# Altium project ECE453-MCU.PrjPcb (part 2 of 3)

## Sheet 03_Connectors.SchDoc: Connectors
size A; Revision: A; SheetNumber: 3; SheetTotal: 8; ECE315_Project_Name: ECE453 Processor Mezzanine
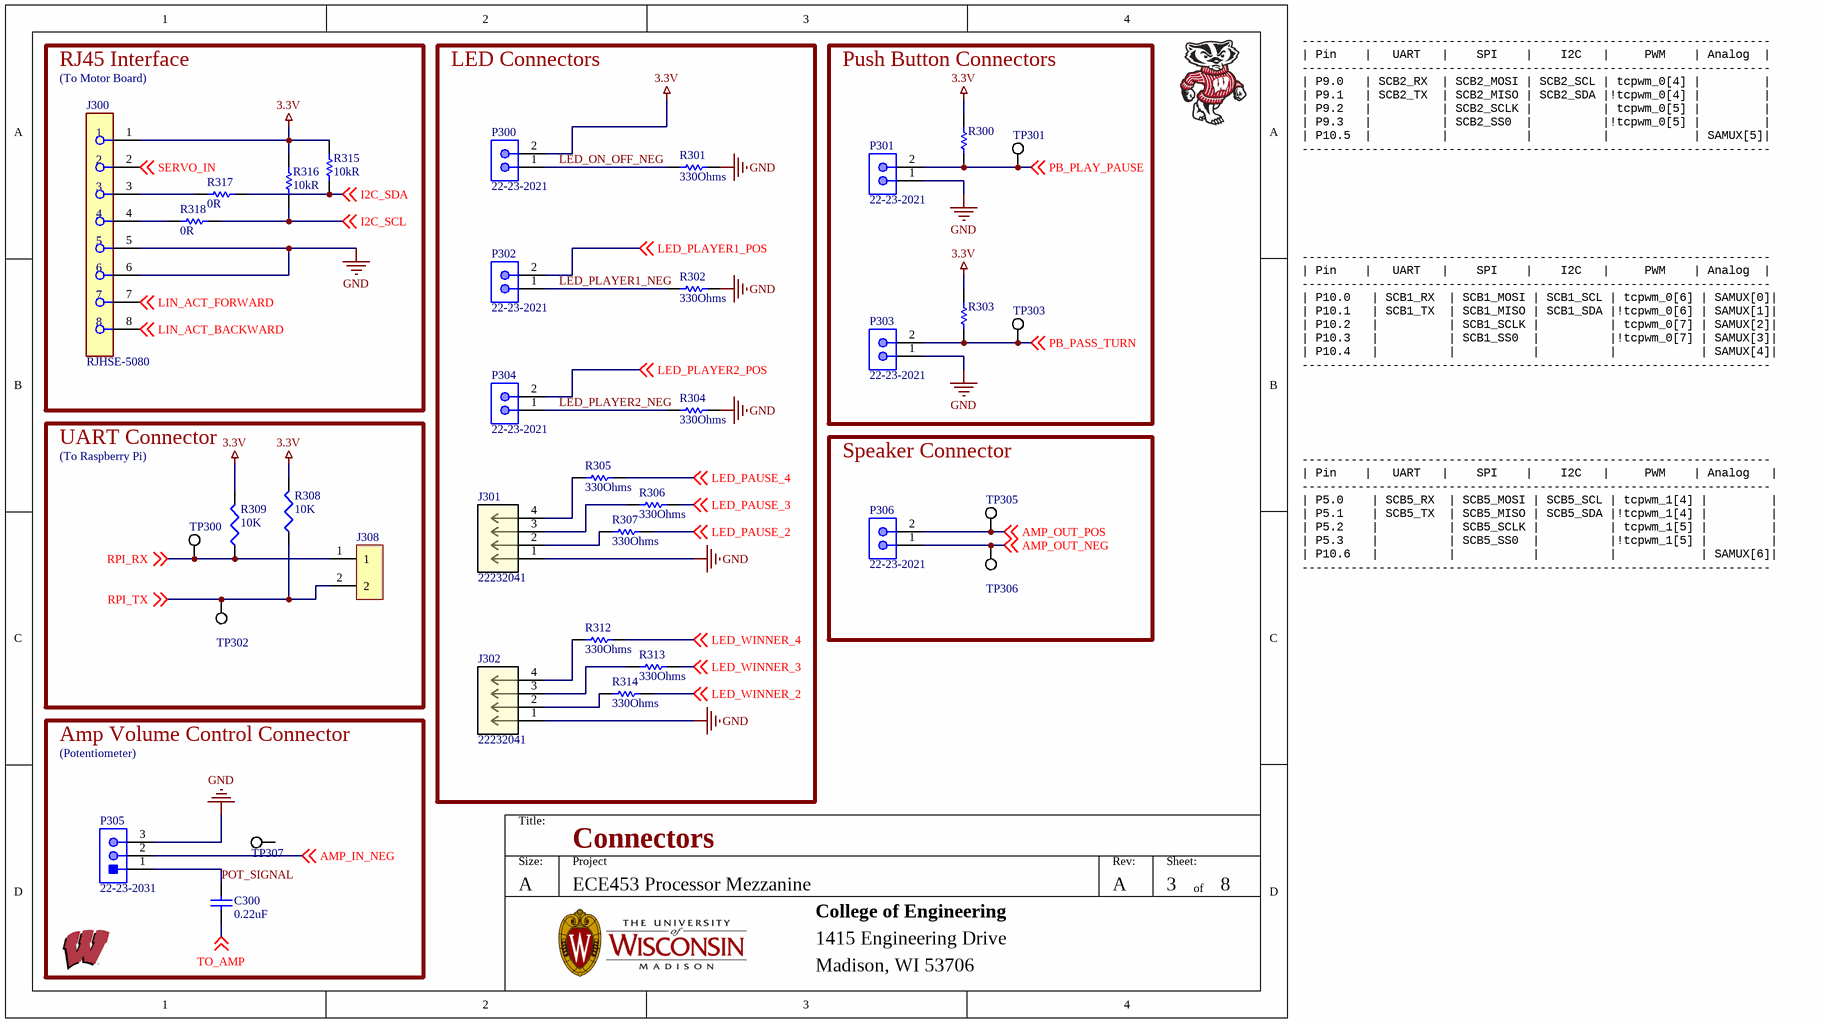
[diagram p3: 03_Connectors.SchDoc]

### Parts
C300  0.22uF  [CAPC2012M]
J300  RJHSE-5080  [FP-RJHSE-5080-MFG]
J301  22232041  [CONN_22-23-2041_MOL]
J302  22232041  [CONN_22-23-2041_MOL]
J308  (no value)  [PHOENIX2X0.2]
P300  22-23-2021  [MOLX-22-23-2021_V]
P301  22-23-2021  [MOLX-22-23-2021_V]
P302  22-23-2021  [MOLX-22-23-2021_V]
P303  22-23-2021  [MOLX-22-23-2021_V]
P304  22-23-2021  [MOLX-22-23-2021_V]
P305  22-23-2031  [MOLX-22-23-2031_V]
P306  22-23-2021  [MOLX-22-23-2021_V]
R300  RC0805FR-0710KL  [RESC2013X60X35NL10T20]  (value not drawn)
R301  Resistance: 330Ohms  [RESC2013X60X35LL10T20]  (hidden comment: RC0805FR-07330RL)
R302  Resistance: 330Ohms  [RESC2013X60X35LL10T20]  (hidden comment: RC0805FR-07330RL)
R303  RC0805FR-0710KL  [RESC2013X60X35NL10T20]  (value not drawn)
R304  Resistance: 330Ohms  [RESC2013X60X35LL10T20]  (hidden comment: RC0805FR-07330RL)
R305  Resistance: 330Ohms  [RESC2013X60X35LL10T20]  (hidden comment: RC0805FR-07330RL)
R306  Resistance: 330Ohms  [RESC2013X60X35LL10T20]  (hidden comment: RC0805FR-07330RL)
R307  Resistance: 330Ohms  [RESC2013X60X35LL10T20]  (hidden comment: RC0805FR-07330RL)
R308  10K  [RESC2012M]
R309  10K  [RESC2012M]
R312  Resistance: 330Ohms  [RESC2013X60X35LL10T20]  (hidden comment: RC0805FR-07330RL)
R313  Resistance: 330Ohms  [RESC2013X60X35LL10T20]  (hidden comment: RC0805FR-07330RL)
R314  Resistance: 330Ohms  [RESC2013X60X35LL10T20]  (hidden comment: RC0805FR-07330RL)
R315  Resistance: 10kR  [RESC2013X60X35NL10T20]  (hidden comment: RC0805FR-0710KL)
R316  Resistance: 10kR  [RESC2013X60X35NL10T20]  (hidden comment: RC0805FR-0710KL)
R317  value 0R  [RESC2013X70X40NL20T20]  (hidden comment: ERJ-6GEY0R00V)
R318  value 0R  [RESC2013X70X40NL20T20]  (hidden comment: ERJ-6GEY0R00V)
TP300  5019  [KSTN-5019_V]  (value not drawn)
TP301  5019  [KSTN-5019_V]  (value not drawn)
TP302  5019  [KSTN-5019_V]  (value not drawn)
TP303  5019  [KSTN-5019_V]  (value not drawn)
TP305  5019  [KSTN-5019_V]  (value not drawn)
TP306  5019  [KSTN-5019_V]  (value not drawn)
TP307  5019  [KSTN-5019_V]  (value not drawn)

### Blocks framed on the sheet
RJ45 Interface: J300 R315-R318
LED Connectors: J301 J302 P300 P302 P304 R301 R302 R304-R307 R312-R314
Push Button Connectors: P301 P303 R300 R303 TP301 TP303
UART Connector: J308 R308 R309 TP300 TP302
Speaker Connector: P306 TP305 TP306
Amp Volume Control Connector: C300 P305 TP307

### Nets
3.3V: J300.1 P300.2 R300.2 R303.2 R308.2 R309.2 R315.2 R316.2
GND: J300.5 J300.6 J301.1 J302.1 P301.1 P303.1 P305.3 R301.1 R302.1 R304.1
AMP_IN_NEG: P305.2 ; off-sheet AMP_IN_NEG
AMP_OUT_NEG: P306.1 TP306.1 ; off-sheet AMP_OUT_NEG
AMP_OUT_POS: P306.2 TP305.1 ; off-sheet AMP_OUT_POS
I2C_SCL: R316.1 R318.2 ; off-sheet I2C_SCL
I2C_SDA: R315.1 R317.2 ; off-sheet I2C_SDA
LED_ON_OFF_NEG: P300.1 R301.2
LED_PAUSE_2: R307.1 ; off-sheet LED_PAUSE_2
LED_PAUSE_3: R306.1 ; off-sheet LED_PAUSE_3
LED_PAUSE_4: R305.1 ; off-sheet LED_PAUSE_4
LED_PLAYER1_NEG: P302.1 R302.2
LED_PLAYER1_POS: P302.2 ; off-sheet LED_PLAYER1_POS
LED_PLAYER2_NEG: P304.1 R304.2
LED_PLAYER2_POS: P304.2 ; off-sheet LED_PLAYER2_POS
LED_WINNER_2: R314.1 ; off-sheet LED_WINNER_2
LED_WINNER_3: R313.1 ; off-sheet LED_WINNER_3
LED_WINNER_4: R312.1 ; off-sheet LED_WINNER_4
LIN_ACT_BACKWARD: J300.8 ; off-sheet LIN_ACT_BACKWARD
LIN_ACT_FORWARD: J300.7 ; off-sheet LIN_ACT_FORWARD
PB_PASS_TURN: P303.2 R303.1 TP303.1 ; off-sheet PB_PASS_TURN
PB_PLAY_PAUSE: P301.2 R300.1 TP301.1 ; off-sheet PB_PLAY_PAUSE
POT_SIGNAL: C300.1 P305.1
RPI_RX: J308.1 R309.1 TP300.1 ; off-sheet RPI_RX
RPI_TX: J308.2 R308.1 TP302.1 ; off-sheet RPI_TX
SERVO_IN: J300.2 ; off-sheet SERVO_IN
TO_AMP: C300.2 ; off-sheet TO_AMP
NetJ300_3: J300.3 R317.1
NetJ300_4: J300.4 R318.1
NetJ301_2: J301.2 R307.2
NetJ301_3: J301.3 R306.2
NetJ301_4: J301.4 R305.2
NetJ302_2: J302.2 R314.2
NetJ302_3: J302.3 R313.2
NetJ302_4: J302.4 R312.2

Not connected (* = marked no-connect by the designer): TP307 1

### Notes on the sheet
- (To Motor Board)
- -------------------------------------------------------------------
  | Pin    |   UART   |    SPI    |    I2C   |     PWM    | Analog  |
  -------------------------------------------------------------------
  | P9.0   | SCB2_RX  | SCB2_MOSI | SCB2_SCL | tcpwm_0[4] |         |
  | P9.1   | SCB2_TX  | SCB2_MISO | SCB2_SDA |!tcpwm_0[4] |         |
  | P9.2   |          | SCB2_SCLK |          | tcpwm_0[5] |         |
  | P9.3   |          | SCB2_SS0  |          |!tcpwm_0[5] |         |
  | P10.5  |          |           |          |            | SAMUX[5]|
  -------------------------------------------------------------------
- -------------------------------------------------------------------
  | Pin    |   UART   |    SPI    |    I2C   |     PWM    | Analog  |
  -------------------------------------------------------------------
  | P10.0   | SCB1_RX  | SCB1_MOSI | SCB1_SCL | tcpwm_0[6] | SAMUX[0]|
  | P10.1   | SCB1_TX  | SCB1_MISO | SCB1_SDA |!tcpwm_0[6] | SAMUX[1]|
  | P10.2   |          | SCB1_SCLK |          | tcpwm_0[7] | SAMUX[2]|
  | P10.3   |          | SCB1_SS0  |          |!tcpwm_0[7] | SAMUX[3]|
  | P10.4   |          |           |          |            | SAMUX[4]|
  -------------------------------------------------------------------
- (To Raspberry Pi)
- -------------------------------------------------------------------
  | Pin    |   UART   |    SPI    |    I2C   |     PWM    | Analog   |
  -------------------------------------------------------------------
  | P5.0    | SCB5_RX  | SCB5_MOSI | SCB5_SCL | tcpwm_1[4] |         |
  | P5.1    | SCB5_TX  | SCB5_MISO | SCB5_SDA |!tcpwm_1[4] |         |
  | P5.2    |          | SCB5_SCLK |          | tcpwm_1[5] |         |
  | P5.3    |          | SCB5_SS0  |          |!tcpwm_1[5] |         |
  | P10.6   |          |           |          |            | SAMUX[6]|
  -------------------------------------------------------------------
- (Potentiometer)
- Title:
- Size:
- A
- Project
- Rev:
- Sheet:
- of
- College of Engineering
- 1415 Engineering Drive
- Madison, WI 53706

### Library data of the parts
C300 = Cap_2: Cap Ceramic 0.22uF 50V X7R 10% SMD 0805 125°C Plastic T/R; Manufacturer: KEMET; Manufacturer Part Number: C0805C224K5RACAUTO7210; Supplier 1: Digi-Key; Supplier Part Number 1: 399-C0805C224K5RACAUTO7210CT-ND; RoHS: Yes; Category: Ceramic Capacitors; Stock 1: 24243; Pricing 1: 1=0.19000, 10=0.12800, 50=0.07680, 100=0.06490, 500=0.04438, 1000=0.03926, 2500=0.03755, 5000=0.03414 (USD); RoHS Compliant: Yes; Value: 0.22uF
J300 = CMP-02366-000003-1: CONN MOD JACK 8P8C R/A UNSHLD; Manufacturer: Amphenol; Current Rating: 1.5A; Voltage Rating: 125V; Pitch: 1.02mm; Conn Orientation: Right Angle; Number Of Contacts: 8; Is Female: yes; Conn Gender: Female; Lead Free: Yes; Device Class L3: unset; Footprint Url: https://cdn.amphenol-icc.com/media/wysiwyg/files/drawing/rjhse5080.pdf?__cf_chl_jschl_tk__=e349db0bbbb6188a39347cd5e541b92fa02c9719-1587748343-0-AW7tChdeHzRPLX9gSWj7WrKaXQoY9BsmT9Ek0h-T62M9y3Rs9iypFcOtkzb-6sGYQEjFE-jcoNciDETCOZrh1rYyOesac5SvYLoLwHIsHvF4AKBlx-MXmfZUVk9OTTJLqyQq2qMm0PFRLJpNcK0nrKResqOniRSYixG2sPTmOPraH-ULJFBDL602CHqcI9KKBgTq90Jh1OL2Td4moJ99rFsJRJ1Tk_uoxGe8ublcP_ARu-uLpWcQrBcwOcHDTAwL29DAwVaqcH7ta8Ks7WMlHmVl_pILeEDwT0bE9vu5Pa5S3PtNRF1leuFkgi_FMbUxTDulc5xzbXSfng8srUIV1lWXny5nx1fZJEUa_w97yKjffzBMxiWLWVN-V7-uqAaPbyv_m-wRyw5O25OZNyJOeGU; ComponentLink2URL: https://cdn.amphenol-icc.com/media/wysiwyg/files/documentation/datasheet/inputoutput/io-modjack-rjhse.pdf; Device Class L1: Connectors; Package: CONN_MOD_JACK; Mouser Description: Modular Connectors / Ethernet Connectors R/A RJ45 NONSHIELDED 8 CONT NO LEDS; Manufacturer Part Number: RJHSE-5080; Octopart: https://octopart.com/rjhse-5080-amphenol-45060; Category: Conn; Height: 0.535inch; Temperature: -55°C to +85°C; Digikey Description: CONN MOD JACK 8P8C R/A UNSHLD; Device Class L2: Modular / Ethernet Connectors; Contact Material: Gold,Nickel; ComponentLink2Description: Datasheet; Temperature Range Low: -55°C; RoHS: TRUE; Automotive: No; Temperature Range High: +85°C
J301 J302 = 22232041: No Description Available; Mfr_Name: Molex Connector Corporation; Copyright: Copyright (C) 2023 Ultra Librarian. All rights reserved.; Manufacturer_Part_Number: 22232041; RefDes: RefDes; Type: DEV
J308 = 2-Pin: 2~24 Poles, Screw Type, Horizontal, 5.08 Pitch, 26~14 (AWG), Terminal Block Connector; Manufacturer: CUI Devices; Manufacturer Part Number: TB006-508-02BE; ComponentLink1URL: https://datasheet.ciiva.com/709/eng-cd-640456-w1-709680.pdf?src-supplier=Digi-Key; ComponentLink1Description: https://datasheet.ciiva.com/709/eng-cd-640456-w1-709680.pdf?src-supplier=Digi-Key; ComponentLink2URL: https://datasheet.ciiva.com/3118/eng-ds-82056-mta-0608-3118497.pdf?src-supplier=Avnet; ComponentLink2Description: https://datasheet.ciiva.com/3118/eng-ds-82056-mta-0608-3118497.pdf?src-supplier=Avnet; ComponentLink3URL: https://datasheet.ciiva.com/16401/eng-ds-82056-mta-0608-16401289.pdf?src-supplier=Future+Electronics; ComponentLink3Description: https://datasheet.ciiva.com/16401/eng-ds-82056-mta-0608-16401289.pdf?src-supplier=Future+Electronics; ComponentLink4URL: https://datasheet.ciiva.com/25617/0900766b80027008-25617244.pdf?src-supplier=RSComponents; ComponentLink4Description: https://datasheet.ciiva.com/25617/0900766b80027008-25617244.pdf?src-supplier=RSComponents; ComponentLink5URL: https://datasheet.ciiva.com/14156/04384301-14156820.pdf?src-supplier=Distrelec; ComponentLink5Description: https://datasheet.ciiva.com/14156/04384301-14156820.pdf?src-supplier=Distrelec; ComponentLink6URL: https://datasheet.ciiva.com/11746/0900766b80eb7fdd-11746365.pdf?src-supplier=RSComponents; ComponentLink6Description: https://datasheet.ciiva.com/11746/0900766b80eb7fdd-11746365.pdf?src-supplier=RSComponents; ComponentLink7URL: https://datasheet.ciiva.com/7128/1866390-7128742.pdf?src-supplier=Newark; ComponentLink7Description: https://datasheet.ciiva.com/7128/1866390-7128742.pdf?src-supplier=Newark; ComponentLink8URL: https://datasheet.ciiva.com/16505/eng-ds-82056-mta-0608-16505419.pdf?src-supplier=Avnet+Asia; ComponentLink8Description: https://datasheet.ciiva.com/16505/eng-ds-82056-mta-0608-16505419.pdf?src-supplier=Avnet+Asia; Supplier: Digi-Key; RoHS: Yes; Category: Terminal Blocks; Stock 1: 50889; Pricing 1: 1=0.86, 10=0.472, 25=0.3524, 50=0.3142, 100=0.308, 250=0.27108, 500=0.24644, 1000=0.2218, 5000=0.16635 (USD); Supplier Part Number: 102-6191-ND
P300-P304 P306 = CMP-1704-00001-3: Male Header, Pitch 2.54 mm, 1 x 2 Position, Height 10.67 mm, Tail Length 3.56 mm, 0 to 75 degC, RoHS, Bulk; Package Quantity: 3000; Height: 10.67 mm; RoHSCompliant: True; ComponentLink2URL: https://datasheet.ciiva.com/19454/232266-19454304.pdf; PartNumber: 22-23-2021; Packaging: Bulk; ComponentLink2Description: Datasheet; Min Operating Temperature: 0 degC; ComponentLink1Description: Manufacturer URL; Length: 5.08 mm; Mounting Technology: Through Hole; Max Operating Temperature: 75 degC; REACH SVHC: Unknown; PackageDescription: Male Header, Pitch 2.54 mm, 1 x 2 Position, Height 10.67 mm, Tail Length 3.56 mm; ComponentLink1URL: http://www.molex.com/; Mount: Through Hole; Radiation Hardening: No; Width: 6.35 mm; Pins: 2
P305 = CMP-2000-05242-1: Male Header, Pitch 2.54 mm, 1 x 3 Position, Height 8.18 mm, Tail Length 3.56 mm, RoHS, Bulk; Current Rating: 4A; Brand: Molex; Pitch: 2.54mm; Voltage Rating: 250V; Mounting Angle: Vertical; Type: Locking; Factory Pack Quantity: 16000; Tradename: KK; Housing Material: Nylon; Contact Material: Brass; Manufacturer URL: http://www.molex.com/; Termination Style: ThroughHole; Mounting Style: ThroughHole; Number of Positions: 3Position; Contact Gender: Pin(Male); Packaging: Bulk; Series: 6373; Datasheet Version: Sep-01; Contact Plating: Tin; Product: Headers; Datasheet URL: https://datasheet.ciiva.com/19472/232274-19472863.pdf; RoHS: Details; Product Category: Headers&WireHousings; Manufacturer: Molex; Number of Rows: 1Row
R300 R303 = CMP-1659-00013-4: Chip Resistor, 10 KOhm, +/- 1%, 0.125 W, -55 to 155 degC, 0805 (2012 Metric), RoHS, Tape and Reel; Manufacturer: Yageo; Voltage Rating: 150 V; Mount: Surface Mount; ComponentLink1Description: Manufacturer URL; ComponentLink2URL: http://www.yageo.com/documents/recent/PYu-RC_Group_51_RoHS_L_04.pdf; Pins: 2; Length: 2 mm; Min Operating Temperature: -55 degC; Height: 0.5 mm; Mounting Technology: Surface Mount; RoHSCompliant: true; REACH SVHC: No SVHC; ComponentLink1URL: http://www.yageo.com/; Max Operating Temperature: 155 degC; PackageReference: 0805; DatasheetVersion: Rev. 4, 02/2016; Package Quantity: 5000; Packaging: Tape and Reel; ComponentLink2Description: Datasheet; PackageDescription: 2-Pin Surface Mounted Device, Body 2 x 1.25 mm
R301 R302 R304-R307 R312-R314 = CMP-2000-06960-1: Chip Resistor, 330 Ohm, +/- 1%, 125 mW, -55 to 155 degC, 0805 (2012 Metric), RoHS, Tape and Reel; Manufacturer: Yageo; Voltage Rating: 150V; Temperature Coefficient: 100PPM/C; Power Rating: 125mW(1/8W); Datasheet Version: Rev. 7, 05/2017; Termination Style: SMD/SMT; Case Code - mm: 2012; Package Description: 2-Pin Surface Mounted Device, Body 2 x 1.25 mm; Operating Temperature Range: -55Cto+155C; Case Code - in: 0805; Packaging: Reel; Tolerance: 1%; Package Reference: 0805; Mounting Technology: SurfaceMount; Product: ThickFilmResistorsGeneralPurpose; Series: RC; Manufacturer URL: http://www.yageo.com/; Datasheet URL: http://www.yageo.com/documents/recent/PYu-RC_Group_51_RoHS_L_7.pdf
R308 R309 = Res3: Res Thick Film 0805 10K Ohm 1% 0.125W ±100ppm/°C Molded SMD Paper T/R; Manufacturer: Stackpole Electronics; Manufacturer Part Number: RMCF0805FT10K0; Power Rating: 125mW; ComponentLink1URL: https://datasheet.ciiva.com/15193/getdatasheetpartid-362046-15193525.pdf?src-supplier=Verical; ComponentLink1Description: https://datasheet.ciiva.com/15193/getdatasheetpartid-362046-15193525.pdf?src-supplier=Verical; Supplier 1: Digi-Key; Supplier Part Number 1: RMCF0805FT10K0CT-ND; RoHS: Yes; Category: Chip SMD Resistors; Stock 1: 3732463; Pricing 1: 1=0.10000, 10=0.02400, 100=0.00970, 1000=0.00437, 2500=0.00379 (USD); Mounting Technology: Surface Mount; Case/Package: 0805; Case Code (Metric): 2012; Case Code (Imperial): 0805; Contact Plating: Tin,Matte; Min Operating Temperature: -55°C; Max Operating Temperature: 155°C; Tolerance: 1%; Packaging: Tape and Reel; Resistor Type: Thick Film; Number of Terminations: 2; Temperature Coefficient: 100ppm/°C; Max Power Dissipation: 125mW; Features: Automotive AEC-Q200; Series: RMCF; Construction: Rectangular; Length: 2mm; Width: 0.049inch; Height: 0.026inch; Depth: 1.25mm; Radiation Hardening: No; Lead Free: Lead Free; Military Standard: Not; RoHS Compliant: Yes; Value: 10K
R315 R316 = CMP-1659-00013-4: Chip Resistor, 10 KOhm, +/- 1%, 0.125 W, -55 to 155 degC, 0805 (2012 Metric), RoHS, Tape and Reel; Manufacturer: Yageo; Voltage Rating: 150 V; Temperature Coefficient: 100ppm/°C; Power Rating: 125mW; Value: 10kR; Mount: Surface Mount; ComponentLink1Description: Manufacturer URL; ComponentLink2URL: http://www.yageo.com/documents/recent/PYu-RC_Group_51_RoHS_L_04.pdf; Pins: 2; Length: 2 mm; Min Operating Temperature: -55 degC; Height: 0.5 mm; Mounting Technology: Surface Mount; RoHSCompliant: true; REACH SVHC: No SVHC; ComponentLink1URL: http://www.yageo.com/; Max Operating Temperature: 155 degC; PackageReference: 0805; DatasheetVersion: Rev. 4, 02/2016; Package Quantity: 5000; Packaging: Tape and Reel; ComponentLink2Description: Datasheet; PackageDescription: 2-Pin Surface Mounted Device, Body 2 x 1.25 mm; Supplier 1: Digi-Key; Supplier Part Number 1: 311-10.0KCRCT-ND; Manufacturer 1: Yageo; Manufacturer Part Number 1: RC0805FR-0710KL; RoHS: Yes; Category: Chip SMD Resistors; Stock 1: 5682818; Pricing 1: 1=0.10000, 10=0.03800, 100=0.01560, 1000=0.00702, 2500=0.00610 (USD); Case/Package: 0805; Case Code (Imperial): 0805; Case Code (Metric): 2012; Size Code: 0805; Tolerance: 1%; Resistor Type: Thick Film; Series: RC; Number of Terminations: 2; Max Power Dissipation: 125mW; Termination: SMD/SMT; Features: Moisture Resistant; Construction: Rectangular; Resistance Tolerance: 1%; Technology: THICK FILM; Width: 0.049inch; Depth: 1.25mm; RoHS Compliant: Yes; Military Standard: Not; Lead Free: Lead Free; ComponentLink3URL: https://datasheet.ciiva.com/11808/0900766b8106beab-11808151.pdf?src-supplier=RSComponents; ComponentLink3Description: https://datasheet.ciiva.com/11808/0900766b8106beab-11808151.pdf?src-supplier=RSComponents; ComponentLink4URL: https://datasheet.ciiva.com/46447/444164-46447563.pdf?src-supplier=Element14; ComponentLink4Description: https://datasheet.ciiva.com/46447/444164-46447563.pdf?src-supplier=Element14; ComponentLink5URL: https://datasheet.ciiva.com/2456/pyu-r-int-thick-7-2456973.pdf?src-supplier=Digi-Key; ComponentLink5Description: https://datasheet.ciiva.com/2456/pyu-r-int-thick-7-2456973.pdf?src-supplier=Digi-Key; ComponentLink6URL: https://datasheet.ciiva.com/2456/pyu-r-int-thick-7-2456974.pdf?src-supplier=Digi-Key; ComponentLink6Description: https://datasheet.ciiva.com/2456/pyu-r-int-thick-7-2456974.pdf?src-supplier=Digi-Key; ComponentLink7URL: https://datasheet.ciiva.com/2456/pyu-r-int-thick-7-2456972.pdf?src-supplier=Digi-Key; ComponentLink7Description: https://datasheet.ciiva.com/2456/pyu-r-int-thick-7-2456972.pdf?src-supplier=Digi-Key; ComponentLink8URL: https://datasheet.ciiva.com/12669/rc0805-12669688.pdf?src-supplier=Mouser; ComponentLink8Description: https://datasheet.ciiva.com/12669/rc0805-12669688.pdf?src-supplier=Mouser; ComponentLink9URL: https://datasheet.ciiva.com/16747/rc0805-16747087.pdf?src-supplier=Future+Electronics; ComponentLink9Description: https://datasheet.ciiva.com/16747/rc0805-16747087.pdf?src-supplier=Future+Electronics; Supplier: Newark; Supplier Part Number: 05M4535; Manufacturer Part Number: RC0805FR-0710KL; Stock: 346650; Pricing: 1=0.102, 10=0.035, 25=0.028, 50=0.021, 100=0.014 (USD); Reach SVHC Compliant: Unknown; ComponentLink10URL: https://datasheet.ciiva.com/11808/0900766b8106beab-11808151.pdf?src-supplier=Rs; ComponentLink10Description: https://datasheet.ciiva.com/11808/0900766b8106beab-11808151.pdf?src-supplier=Rs
R317 R318 = CMP-1665-00002-5: Chip Resistor, 0 Ohm, +/- 1%, 0.125 W, -55 to 155 degC, 0805 (2012 Metric), RoHS, Tape and Reel; Manufacturer: Panasonic; Tolerance: 5%; Resistance: 0 Ohm; Power Rating: 125mW; Temperature Coefficient: 600ppm/°C; Voltage Rating: 150V; Current Rating: 2A; REACH SVHC: No SVHC; Min Operating Temperature: -55 degC; Case/Package: 0805; Packaging: Tape and Reel; Package Quantity: 5000; ComponentLink1Description: Manufacturer URL; PackageDescription: 2-Pin Surface Mount Device, Body 2 x 1.25 mm; Mounting Technology: Surface Mount; Max Operating Temperature: 155 degC; PartNumber: ERJ-6GEY0R00V; Width: 1.25 mm; RoHSCompliant: True; Height: 0.6 mm; ComponentLink1URL: http://www.panasonic.com/; ComponentLink2URL: http://industrial.panasonic.com/cdbs/www-data/pdf/RDA0000/AOA0000C84.pdf; Case Code (Imperial): 0805; DatasheetVersion: 03/2015; Length: 2 mm; Case Code (Metric): 2012; ComponentLink2Description: Datasheet; Radiation Hardening: No; Supplier: Newark; Supplier Part Number: 65T8846; Manufacturer Part Number: ERJ-6GEY0R00V; RoHS: Yes; Category: Chip SMD Resistors; Stock: 200593; Pricing: 1=0.008, 25=0.008, 50=0.008, 100=0.008, 250=0.008, 500=0.008, 1000=0.008 (USD); Contact Plating: Tin; Series: ERJ; Termination: SMD/SMT; Resistor Type: Thick Film; Number of Terminations: 2; Technology: THICK FILM; Construction: Rectangular; Max Power Dissipation: 125mW; Voltage Rating (DC): 150V; Features: Automotive AEC-Q200; Depth: 1.25mm; Ratings: AEC-Q200; RoHS Compliant: Yes; Reach SVHC Compliant: No; Military Standard: Not; Lead Free: Lead Free
TP300-TP303 TP305-TP307 = CMP-1672-00008-1: Test Point, 1 Position SMD, RoHS, Tape and Reel; Mounting Technology: Surface Mount; Pins: 1; Contact Plating: Silver; Packaging: Tape and Reel; Package Quantity: 1000; ComponentLink1URL: http://www.keyelco.com/; ComponentLink1Description: Manufacturer URL; ComponentLink2URL: http://www.keyelco.com/product-pdf.cfm?p=1357; ComponentLink2Description: Datasheet; DatasheetVersion: 03/2014; Mount: Surface Mount; PackageDescription: 1-Pin Surface Mount Device, Body 3.81 x 2.03 mm; RoHSCompliant: True; PackageReference: 5019

## Sheet 04-MCU.SchDoc: PSoC6
size A; Revision: A; SheetNumber: 4; SheetTotal: 8; ECE315_Project_Name: ECE453 Processor Mezzanine
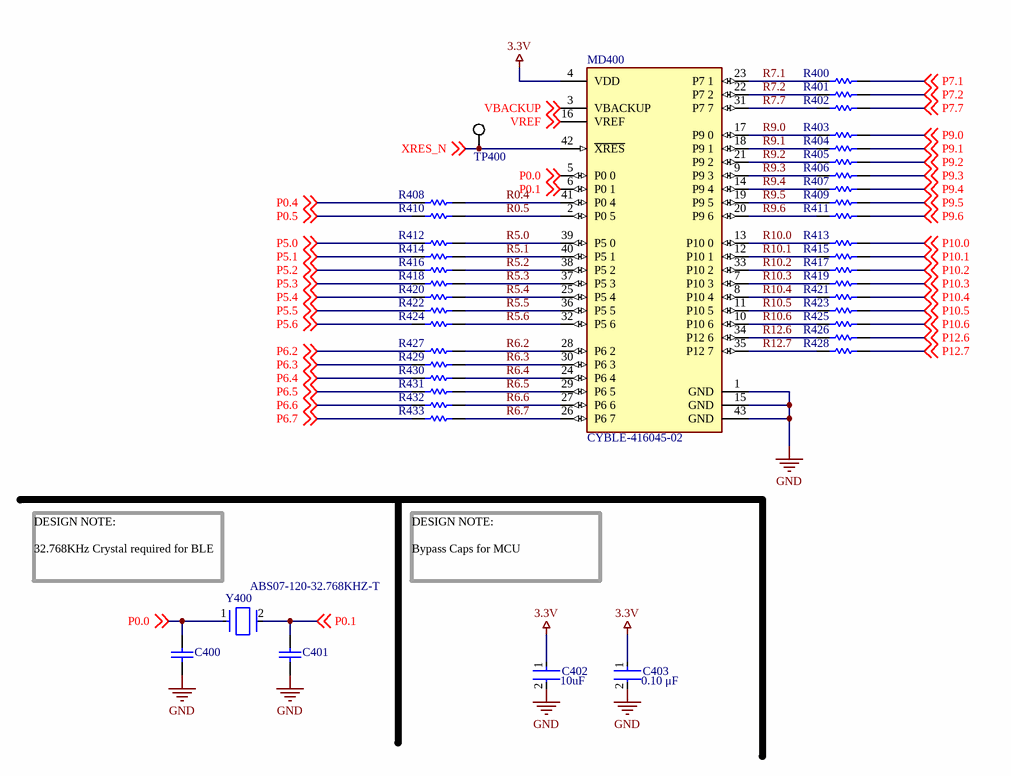
[diagram p4: 04-MCU.SchDoc]

### Parts
C400  08055A6R0CAT2A  [CAPC2013X94X50LL20T25]  (value not drawn)
C401  08055A6R0CAT2A  [CAPC2013X94X50LL20T25]  (value not drawn)
C402  value 10uF  [FP-C0805C-DG-MFG]  (hidden comment: C0805C106K8PACTU)
C403  value 0.10 μF  [FP-C0805C-DN-MFG]  (hidden comment: C0805C104K5RACTU)
MD400  CYBLE-416045-02  [FP-CYBLE-416045-02-MFG]
R400  ERA6AEB101V  [RESC2013X60X40ML20T25]  (value not drawn)
R401  ERA6AEB101V  [RESC2013X60X40ML20T25]  (value not drawn)
R402  ERA6AEB101V  [RESC2013X60X40ML20T25]  (value not drawn)
R403  ERA6AEB101V  [RESC2013X60X40ML20T25]  (value not drawn)
R404  ERA6AEB101V  [RESC2013X60X40ML20T25]  (value not drawn)
R405  ERA6AEB101V  [RESC2013X60X40ML20T25]  (value not drawn)
R406  ERA6AEB101V  [RESC2013X60X40ML20T25]  (value not drawn)
R407  ERA6AEB101V  [RESC2013X60X40ML20T25]  (value not drawn)
R408  ERA6AEB101V  [RESC2013X60X40ML20T25]  (value not drawn)
R409  ERA6AEB101V  [RESC2013X60X40ML20T25]  (value not drawn)
R410  ERA6AEB101V  [RESC2013X60X40ML20T25]  (value not drawn)
R411  ERA6AEB101V  [RESC2013X60X40ML20T25]  (value not drawn)
R412  ERA6AEB101V  [RESC2013X60X40ML20T25]  (value not drawn)
R413  ERA6AEB101V  [RESC2013X60X40ML20T25]  (value not drawn)
R414  ERA6AEB101V  [RESC2013X60X40ML20T25]  (value not drawn)
R415  ERA6AEB101V  [RESC2013X60X40ML20T25]  (value not drawn)
R416  ERA6AEB101V  [RESC2013X60X40ML20T25]  (value not drawn)
R417  ERA6AEB101V  [RESC2013X60X40ML20T25]  (value not drawn)
R418  ERA6AEB101V  [RESC2013X60X40ML20T25]  (value not drawn)
R419  ERA6AEB101V  [RESC2013X60X40ML20T25]  (value not drawn)
R420  ERA6AEB101V  [RESC2013X60X40ML20T25]  (value not drawn)
R421  ERA6AEB101V  [RESC2013X60X40ML20T25]  (value not drawn)
R422  ERA6AEB101V  [RESC2013X60X40ML20T25]  (value not drawn)
R423  ERA6AEB101V  [RESC2013X60X40ML20T25]  (value not drawn)
R424  ERA6AEB101V  [RESC2013X60X40ML20T25]  (value not drawn)
R425  ERA6AEB101V  [RESC2013X60X40ML20T25]  (value not drawn)
R426  ERA6AEB101V  [RESC2013X60X40ML20T25]  (value not drawn)
R427  ERA6AEB101V  [RESC2013X60X40ML20T25]  (value not drawn)
R428  ERA6AEB101V  [RESC2013X60X40ML20T25]  (value not drawn)
R429  ERA6AEB101V  [RESC2013X60X40ML20T25]  (value not drawn)
R430  ERA6AEB101V  [RESC2013X60X40ML20T25]  (value not drawn)
R431  ERA6AEB101V  [RESC2013X60X40ML20T25]  (value not drawn)
R432  ERA6AEB101V  [RESC2013X60X40ML20T25]  (value not drawn)
R433  ERA6AEB101V  [RESC2013X60X40ML20T25]  (value not drawn)
TP400  5019  [KSTN-5019_V]  (value not drawn)
Y400  ABS07-120-32.768KHZ-T  [FP-ABS07-120-MFG]

### Nets
3.3V: C402.1 C403.1 MD400.4(VDD)
GND: C400.1 C401.1 C402.2 C403.2 MD400.1(GND) MD400.15(GND) MD400.43(GND)
P0.0: C400.2 MD400.5(P0_0) Y400.1 ; off-sheet P0.0
P0.1: C401.2 MD400.6(P0_1) Y400.2 ; off-sheet P0.1
P0.4: R408.1 ; off-sheet P0.4
P0.5: R410.1 ; off-sheet P0.5
P5.0: R412.1 ; off-sheet P5.0
P5.1: R414.1 ; off-sheet P5.1
P5.2: R416.1 ; off-sheet P5.2
P5.3: R418.1 ; off-sheet P5.3
P5.4: R420.1 ; off-sheet P5.4
P5.5: R422.1 ; off-sheet P5.5
P5.6: R424.1 ; off-sheet P5.6
P6.2: R427.1 ; off-sheet P6.2
P6.3: R429.1 ; off-sheet P6.3
P6.4: R430.1 ; off-sheet P6.4
P6.5: R431.1 ; off-sheet P6.5
P6.6: R432.1 ; off-sheet P6.6
P6.7: R433.1 ; off-sheet P6.7
P7.1: R400.2 ; off-sheet P7.1
P7.2: R401.2 ; off-sheet P7.2
P7.7: R402.2 ; off-sheet P7.7
P9.0: R403.2 ; off-sheet P9.0
P9.1: R404.2 ; off-sheet P9.1
P9.2: R405.2 ; off-sheet P9.2
P9.3: R406.2 ; off-sheet P9.3
P9.4: R407.2 ; off-sheet P9.4
P9.5: R409.2 ; off-sheet P9.5
P9.6: R411.2 ; off-sheet P9.6
P10.0: R413.2 ; off-sheet P10.0
P10.1: R415.2 ; off-sheet P10.1
P10.2: R417.2 ; off-sheet P10.2
P10.3: R419.2 ; off-sheet P10.3
P10.4: R421.2 ; off-sheet P10.4
P10.5: R423.2 ; off-sheet P10.5
P10.6: R425.2 ; off-sheet P10.6
P12.6: R426.2 ; off-sheet P12.6
P12.7: R428.2 ; off-sheet P12.7
R0.4: MD400.41(P0_4) R408.2
R0.5: MD400.2(P0_5) R410.2
R5.0: MD400.39(P5_0) R412.2
R5.1: MD400.40(P5_1) R414.2
R5.2: MD400.38(P5_2) R416.2
R5.3: MD400.37(P5_3) R418.2
R5.4: MD400.25(P5_4) R420.2
R5.5: MD400.36(P5_5) R422.2
R5.6: MD400.32(P5_6) R424.2
R6.2: MD400.28(P6_2) R427.2
R6.3: MD400.30(P6_3) R429.2
R6.4: MD400.24(P6_4) R430.2
R6.5: MD400.29(P6_5) R431.2
R6.6: MD400.27(P6_6) R432.2
R6.7: MD400.26(P6_7) R433.2
R7.1: MD400.23(P7_1) R400.1
R7.2: MD400.22(P7_2) R401.1
R7.7: MD400.31(P7_7) R402.1
R9.0: MD400.17(P9_0) R403.1
R9.1: MD400.18(P9_1) R404.1
R9.2: MD400.21(P9_2) R405.1
R9.3: MD400.9(P9_3) R406.1
R9.4: MD400.14(P9_4) R407.1
R9.5: MD400.19(P9_5) R409.1
R9.6: MD400.20(P9_6) R411.1
R10.0: MD400.13(P10_0) R413.1
R10.1: MD400.12(P10_1) R415.1
R10.2: MD400.33(P10_2) R417.1
R10.3: MD400.7(P10_3) R419.1
R10.4: MD400.8(P10_4) R421.1
R10.5: MD400.11(P10_5) R423.1
R10.6: MD400.10(P10_6) R425.1
R12.6: MD400.34(P12_6) R426.1
R12.7: MD400.35(P12_7) R428.1
VBACKUP: MD400.3(VBACKUP) ; off-sheet VBACKUP
VREF: MD400.16(VREF) ; off-sheet VREF
XRES_N: MD400.42(~{XRES}) TP400.1 ; off-sheet XRES_N

### Notes on the sheet
- (near Y400) DESIGN NOTE:
  32.768KHz Crystal required for BLE
- DESIGN NOTE:
  Bypass Caps for MCU
- Title:
- Size:
- A
- Project
- Rev:
- Sheet:
- of
- College of Engineering
- 1415 Engineering Drive
- Madison, WI 53706

### Library data of the parts
C400 C401 = CMP-2007-04344-1: Manufacturer: AVX Interconnect / Elco; Part Number: 08055A6R0CAT2A
C402 = CMP-2007-03243-2: CAP CER 10UF 10V X5R 0805; Manufacturer: Kemet; 3DS Part Number: 220-00001; Tolerance: 10%; Temperature Coefficient: 15%; Material: Ceramic; Manufacturer Part Number: C0805C106K8PACTU; RoHS: TRUE; Category: Cap; Voltage Rating: 10V; Voltage: 10V; Height: 1.4mm; Device Class L2: Capacitors; Device Class L1: Passive Components; ComponentLink2URL: https://content.kemet.com/datasheets/KEM_C1006_X5R_SMD.pdf; Lead Free: Yes; Digikey Description: CAP CER 10UF 10V X5R 0805; Octopart: https://octopart.com/c0805c106k8pactu-kemet-98697; Capacitance: 10uF; Temperature Range Low: -55°C; Temperature: -55°C to +85°C; Automotive: No; Mouser Description: CAP CER 10UF 10V X5R 0805; Ipc Land Pattern Name: CAPC200125X125; Temperature Range High: +85°C; Device Class L3: Ceramic Capacitors; ComponentLink2Description: Datasheet; Package: C0805C-DG; Temperature Characteristic: X5R
C403 = CMP-2007-00279-2: CAP CER 0.1UF 50V X7R 0805; Manufacturer: KEMET; Tolerance: 0.1; Temperature Coefficient: 30ppm/°C; Material: Ceramic; ComponentLink2Description: Datasheet; ComponentLink2URL: https://content.kemet.com/datasheets/KEM_C1003_C0G_SMD.pdf; Manufacturer Part Number: C0805C104K5RACTU; RoHS: TRUE; Category: Cap; Voltage Rating: 50 V; Height: 0.88mm; Device Class L2: Capacitors; Temperature Range Low: -55°C; Digikey Description: CAP CER 0.1UF 50V X7R 0805; Octopart: https://octopart.com/c0805c104k5ractu-kemet-143926; Temperature Characteristic: X7R; Temperature: -55°C to +125°C; Temperature Range High: +125°C; Device Class L1: Passive Components; Automotive: No; Lead Free: Yes; Ipc Land Pattern Name: CAPC200125X78; Device Class L3: Ceramic Capacitors; Mouser Description: Cap Ceramic 0.1uF 50V X7R 10% SMD 2.0 x 1.2 mm 125 C Paper T/R; Capacitance: 0.10 μF; Package: C0805C-DN
MD400 = CMP-12964-000002-1: RF TXRX MOD BLUETOOTH TRACE ANT; Manufacturer: Cypress Semiconductor; Number Of Gpio: 36; Number Of Adc Channels: 1; Max Supply Voltage: 3.6V; Min Supply Voltage: 1.71V; Data Rate: 2Mbits/s; Receiving Current: 6.7mA; Max Frequency: 2.5GHz; Bandwidth: 100MHz; Transmitting Current: 5.7mA; Interface: I2C,SPI,UART,I2S,Other; Octopart: https://octopart.com/cyble-416045-02-cypress+semiconductor-96386825; Lead Free: Yes; RoHS: TRUE; Device Class L3: Transceivers; Category: UNK; Package: 0; Device Class L2: RF Semiconductors and Devices; Automotive: No; ComponentLink2URL: https://www.cypress.com/file/428336/download; Temperature Range Low: -40°C; Height: 2mm; Device Class L1: Integrated Circuits (ICs); Manufacturer Part Number: CYBLE-416045-02; ComponentLink2Description: Datasheet; Digikey Description: RF TXRX MOD BLUETOOTH TRACE ANT; Temperature: -40°C to +85°C; Temperature Range High: +85°C
R400-R433 = CMP-2001-00580-1: Manufacturer: Panasonic; Part Number: ERA6AEB101V
TP400 = CMP-1672-00008-1: as TP300 on sheet 03_Connectors; Mounting Technology: Surface Mount; Pins: 1; Contact Plating: Silver; Packaging: Tape and Reel; Package Quantity: 1000; ComponentLink1URL: http://www.keyelco.com/; ComponentLink1Description: Manufacturer URL; ComponentLink2URL: http://www.keyelco.com/product-pdf.cfm?p=1357; ComponentLink2Description: Datasheet; DatasheetVersion: 03/2014; Mount: Surface Mount; PackageDescription: 1-Pin Surface Mount Device, Body 3.81 x 2.03 mm; RoHSCompliant: True; PackageReference: 5019
Y400 = CMP-2000-07587-2: CRYSTAL 32.7680KHZ 6PF SMD; Tolerance: 20ppm; ESR (Equivalent Series Resistance): 55kR; Series Resistance: 60kR; Case/Package: SMD/SMT; Min Operating Temperature: -40°C; Max Operating Temperature: 85°C; Frequency: 32.768kHz; Load Capacitance: 6pF; Frequency Tolerance: 20ppm; Packaging: Tape and Reel; Package Quantity: 3000; Termination: SMD/SMT; Series: ABS07; Operating Frequency: 32.768 kHz; Length: 3.2mm; Width: 0.061inch; Height: 0.035inch; Depth: 1.5mm; Radiation Hardening: No; Lead Free: Lead Free; RoHS Compliant: Yes; Number of Pins: 2; REACH SVHC: No SVHC; Mount: Surface Mount

## Sheet 05_Mechanicals.SchDoc: Mechanicals
size A; Revision: A; SheetNumber: 5; SheetTotal: 8; ECE315_Project_Name: ECE453 Processor Mezzanine
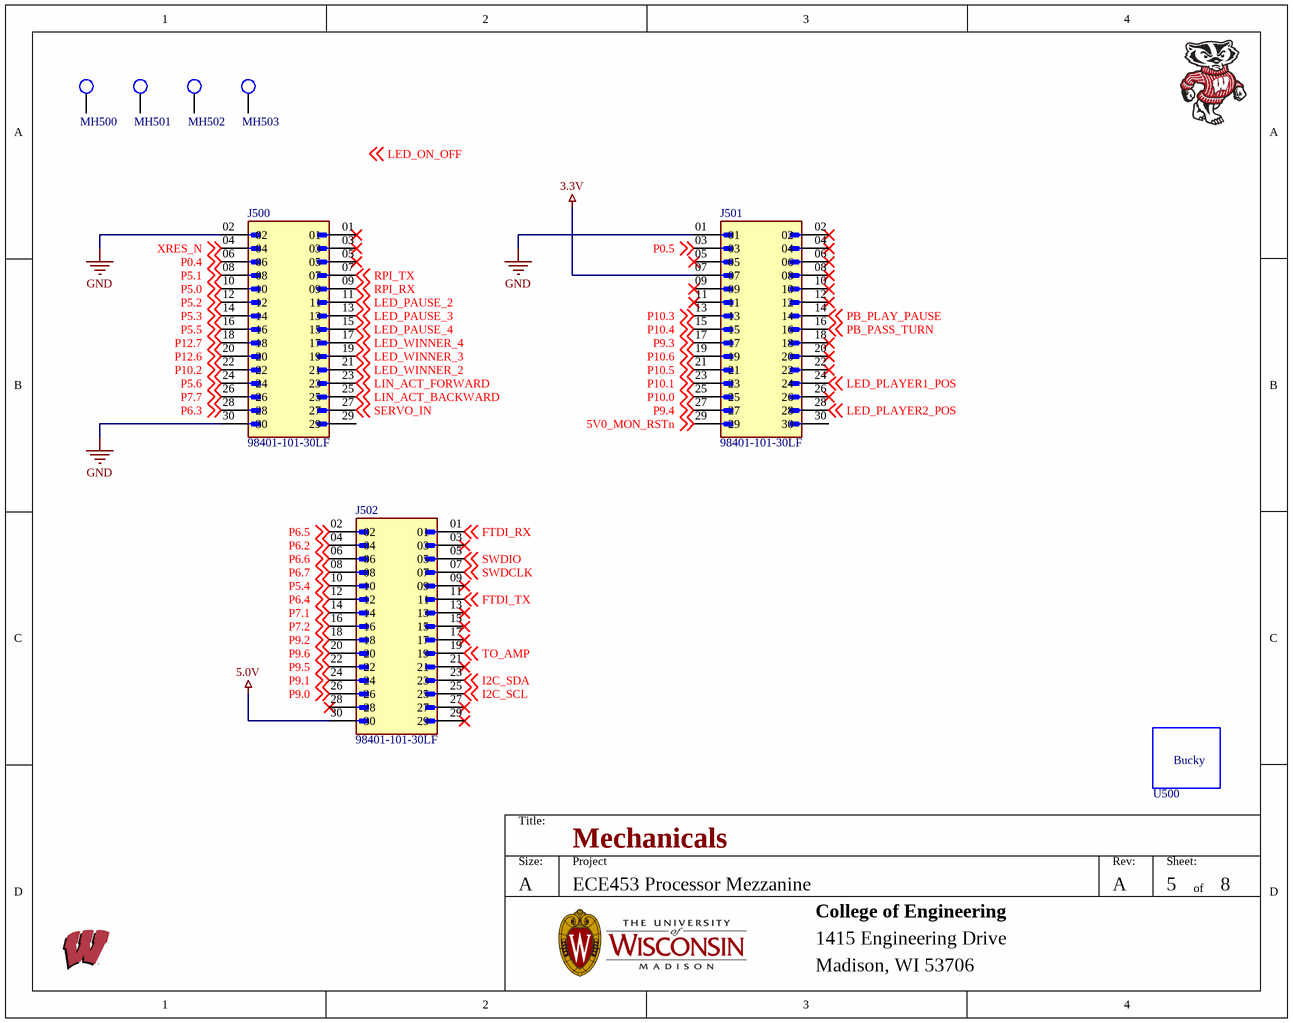
[diagram p5: 05_Mechanicals.SchDoc]

### Parts
J500  98401-101-30LF  [AMPHENOL_98401-101-30LF]
J501  98401-101-30LF  [AMPHENOL_98401-101-30LF]
J502  98401-101-30LF  [AMPHENOL_98401-101-30LF]
MH500  MHOLE_2_55MM  [MHOLE_2_55MM]  (value not drawn)  (no BOM)
MH501  MHOLE_2_55MM  [MHOLE_2_55MM]  (value not drawn)  (no BOM)
MH502  MHOLE_2_55MM  [MHOLE_2_55MM]  (value not drawn)  (no BOM)
MH503  MHOLE_2_55MM  [MHOLE_2_55MM]  (value not drawn)  (no BOM)
U500  Bucky  [WalkingBucky]  (value not drawn)  (no BOM)

### Nets
3.3V: J501.07
5.0V: J502.30
GND: J500.02 J500.30 J501.01
5V0_MON_RSTn: J501.29 ; off-sheet 5V0_MON_RSTn
FTDI_RX: J502.01 ; off-sheet FTDI_RX
FTDI_TX: J502.11 ; off-sheet FTDI_TX
I2C_SCL: J502.25 ; off-sheet I2C_SCL
I2C_SDA: J502.23 ; off-sheet I2C_SDA
LED_PAUSE_2: J500.11 ; off-sheet LED_PAUSE_2
LED_PAUSE_3: J500.13 ; off-sheet LED_PAUSE_3
LED_PAUSE_4: J500.15 ; off-sheet LED_PAUSE_4
LED_PLAYER1_POS: J501.24 ; off-sheet LED_PLAYER1_POS
LED_PLAYER2_POS: J501.28 ; off-sheet LED_PLAYER2_POS
LED_WINNER_2: J500.21 ; off-sheet LED_WINNER_2
LED_WINNER_3: J500.19 ; off-sheet LED_WINNER_3
LED_WINNER_4: J500.17 ; off-sheet LED_WINNER_4
LIN_ACT_BACKWARD: J500.25 ; off-sheet LIN_ACT_BACKWARD
LIN_ACT_FORWARD: J500.23 ; off-sheet LIN_ACT_FORWARD
P0.4: J500.06 ; off-sheet P0.4
P0.5: J501.03 ; off-sheet P0.5
P5.0: J500.10 ; off-sheet P5.0
P5.1: J500.08 ; off-sheet P5.1
P5.2: J500.12 ; off-sheet P5.2
P5.3: J500.14 ; off-sheet P5.3
P5.4: J502.10 ; off-sheet P5.4
P5.5: J500.16 ; off-sheet P5.5
P5.6: J500.24 ; off-sheet P5.6
P6.2: J502.04 ; off-sheet P6.2
P6.3: J500.28 ; off-sheet P6.3
P6.4: J502.12 ; off-sheet P6.4
P6.5: J502.02 ; off-sheet P6.5
P6.6: J502.06 ; off-sheet P6.6
P6.7: J502.08 ; off-sheet P6.7
P7.1: J502.14 ; off-sheet P7.1
P7.2: J502.16 ; off-sheet P7.2
P7.7: J500.26 ; off-sheet P7.7
P9.0: J502.26 ; off-sheet P9.0
P9.1: J502.24 ; off-sheet P9.1
P9.2: J502.18 ; off-sheet P9.2
P9.3: J501.17 ; off-sheet P9.3
P9.4: J501.27 ; off-sheet P9.4
P9.5: J502.22 ; off-sheet P9.5
P9.6: J502.20 ; off-sheet P9.6
P10.0: J501.25 ; off-sheet P10.0
P10.1: J501.23 ; off-sheet P10.1
P10.2: J500.22 ; off-sheet P10.2
P10.3: J501.13 ; off-sheet P10.3
P10.4: J501.15 ; off-sheet P10.4
P10.5: J501.21 ; off-sheet P10.5
P10.6: J501.19 ; off-sheet P10.6
P12.6: J500.20 ; off-sheet P12.6
P12.7: J500.18 ; off-sheet P12.7
PB_PASS_TURN: J501.16 ; off-sheet PB_PASS_TURN
PB_PLAY_PAUSE: J501.14 ; off-sheet PB_PLAY_PAUSE
RPI_RX: J500.09 ; off-sheet RPI_RX
RPI_TX: J500.07 ; off-sheet RPI_TX
SERVO_IN: J500.27 ; off-sheet SERVO_IN
SWDCLK: J502.07 ; off-sheet SWDCLK
SWDIO: J502.05 ; off-sheet SWDIO
TO_AMP: J502.19 ; off-sheet TO_AMP
XRES_N: J500.04 ; off-sheet XRES_N

Not connected (* = marked no-connect by the designer): J500 01* 03* 05* 29; J501 02* 04* 05* 06* 08* 09* 10* 11* 12* 18* 20* 22* 26* 30; J502 03* 09* 13* 15* 17* 21* 27* 28* 29*; MH500 1; MH501 1; MH502 1; MH503 1

### Notes on the sheet
- Labels drawn without touching a wire or pin: LED_ON_OFF
- Title:
- Size:
- A
- Project
- Rev:
- Sheet:
- of
- College of Engineering
- 1415 Engineering Drive
- Madison, WI 53706

### Library data of the parts
J500-J502 = 98401-101-30LF: Conn Unshrouded Header HDR 30 POS 2.54mm Solder ST SMD T/R; Manufacturer 1: Amphenol ICC / FCI; Manufacturer Part Number: 95278-101A30LF; MF: Amphenol ICC (FCI); Number of Contacts: 30; Max Voltage Rating (AC): 1.5kV; Current Rating: 3A; Insulation Resistance: 5GR; Row Spacing: 0.1inch; Gender: Male; Package: None; Price: None; Value: *; MP: 98401-101-30LF; Availability: Unavailable; Supplier 1: Digi-Key; Supplier Part Number 1: 98401-101-30LF-ND; Manufacturer Part Number 1: 98401-101-30LF; RoHS: Yes; Category: Headers and Wire Housings; Pricing 1: 400=1.30895 (USD); Mount: Surface Mount; Contact Plating: Gold,GXT; Contact Material: Bronze; Color: Black; Housing Color: Black; Housing Material: Thermoplastic; Min Operating Temperature: -65°C; Max Operating Temperature: 125°C; Number of Rows: 2; Termination: Solder; Package Quantity: 200; Packaging: Bulk; Number of Positions: 30; Orientation: Straight; Series: BERGSTIK®, MezzSelect™, Basics+; Voltage Rating: 1.5kV; Contact Gender: Male; Contact Type: Male Pin; Length: 38.1mm; Pitch: 2.54mm; Depth: 4.83mm; Contact Mating Length: 0.23inch; RoHS Compliant: Yes; Flammability Rating: UL94 V-0; ComponentLink1URL: https://datasheet.ciiva.com/5168/98401-274167-5168660.pdf?src-supplier=Mouser; ComponentLink1Description: https://datasheet.ciiva.com/5168/98401-274167-5168660.pdf?src-supplier=Mouser; ComponentLink2URL: https://datasheet.ciiva.com/10120/98401-10120570.pdf?src-supplier=Avnet; ComponentLink2Description: https://datasheet.ciiva.com/10120/98401-10120570.pdf?src-supplier=Avnet; ComponentLink3URL: https://datasheet.ciiva.com/724/98401-724961.pdf?src-supplier=Digi-Key; ComponentLink3Description: https://datasheet.ciiva.com/724/98401-724961.pdf?src-supplier=Digi-Key; Supplier: Newark; Supplier Part Number: 63K1615; Manufacturer: Amphenol ICC / FCI; Pricing: 370=1.45, 1000=1.44, 2000=1.39, 4000=1.32, 6000=1.3, 10000=1.28 (USD); Mounting Technology: Surface Mount; ComponentLink4URL: https://datasheet.ciiva.com/724/95278-724949.pdf?src-supplier=Digi-Key; ComponentLink4Description: https://datasheet.ciiva.com/724/95278-724949.pdf?src-supplier=Digi-Key
MH500-MH503 = MHOLE_2_55MM: Mounting Holde; Manufacturer Part Number: UW MTHOLE
U500 = Bucky: Bucky Badger Image; Manufacturer Part Number: UW Bucky

## Sheet 07_Programming_Reset.SchDoc: Programming/Reset
size A; Revision: A; SheetNumber: 7; SheetTotal: 8; ECE315_Project_Name: ECE453 Processor Mezzanine
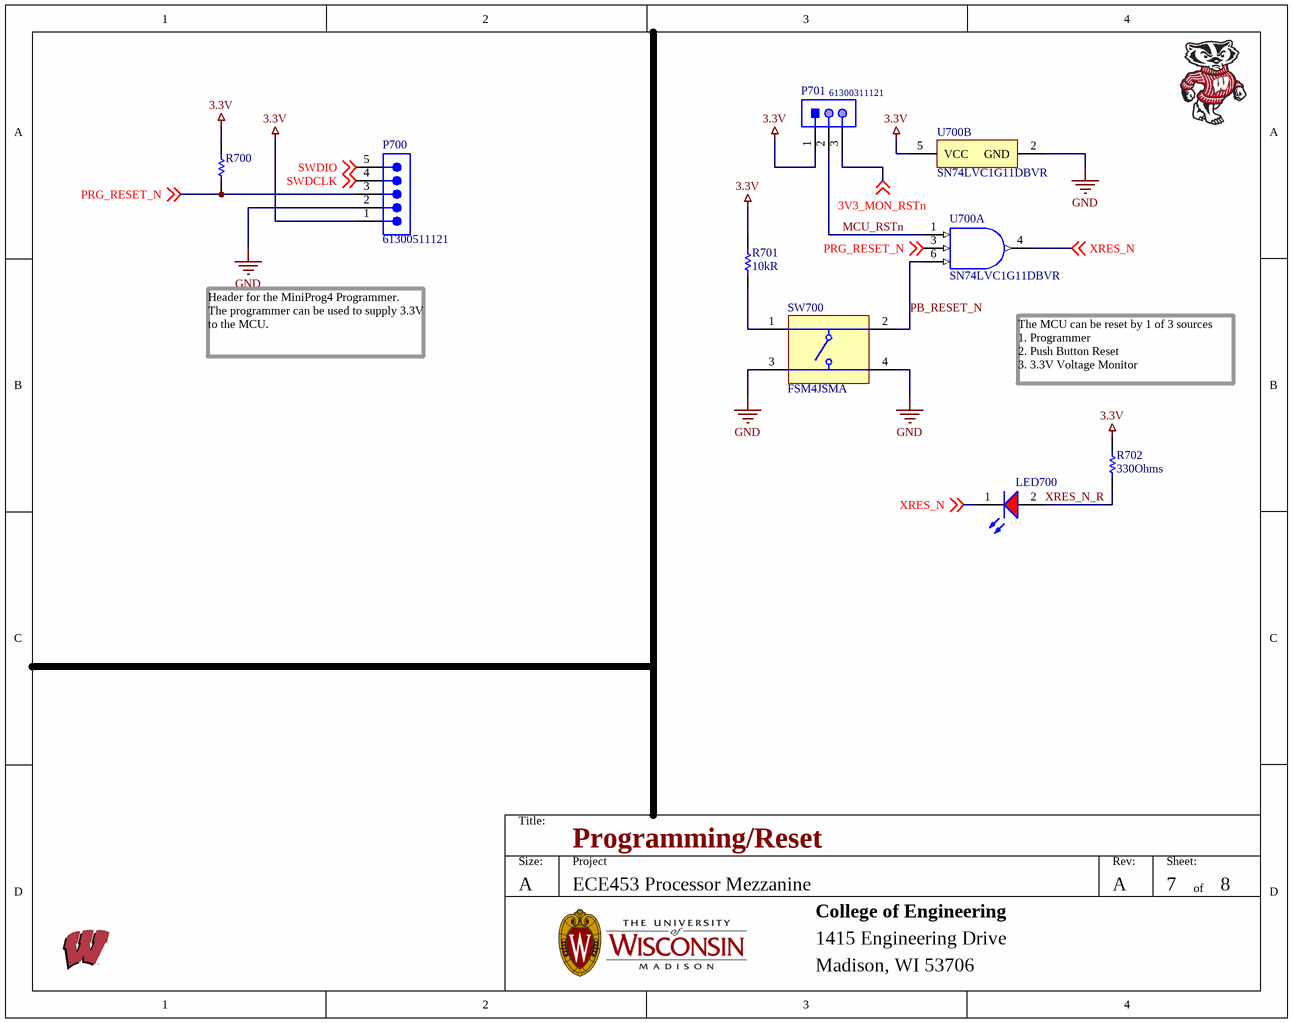
[diagram p6: 07_Programming_Reset.SchDoc]

### Parts
LED700  150080RS75000  [WL-SMCW_0805_150080xx75000]  (value not drawn)
P700  61300511121  [61300511121]
P701  61300311121  [61300311121]
R700  RC0805FR-0710KL  [RESC2013X60X35NL10T20]  (value not drawn)
R701  Resistance: 10kR  [RESC2013X60X35NL10T20]  (hidden comment: RC0805FR-0710KL)
R702  Resistance: 330Ohms  [RESC2013X60X35LL10T20]  (hidden comment: RC0805FR-07330RL)
SW700  FSM4JSMA  [TECO-FSM4JSMA_V]
U700  SN74LVC1G11DBVR  [DBV0006A_N]  (parts A,B of 2)

### Nets
3.3V: P700.1 P701.1 R700.2 R701.2 R702.2 U700.5(VCC)
GND: P700.2 SW700.3 SW700.4 U700.2(GND)
3V3_MON_RSTn: P701.3 ; off-sheet 3V3_MON_RSTn
MCU_RSTn: P701.2 U700.1(A)
PB_RESET_N: SW700.2 U700.6(C)
PRG_RESET_N: P700.3 R700.1 U700.3(B) ; off-sheet PRG_RESET_N
SWDCLK: P700.4 ; off-sheet SWDCLK
SWDIO: P700.5 ; off-sheet SWDIO
XRES_N: LED700.1(K) U700.4(Y) ; off-sheet XRES_N
XRES_N_R: LED700.2(A) R702.1
NetR701_1: R701.1 SW700.1

### Notes on the sheet
- Header for the MiniProg4 Programmer.  The programmer can be used to supply 3.3V to the MCU.
- The MCU can be reset by 1 of 3 sources
  1. Programmer
  2. Push Button Reset
  3. 3.3V Voltage Monitor
- Title:
- Size:
- A
- Project
- Rev:
- Sheet:
- of
- College of Engineering
- 1415 Engineering Drive
- Madison, WI 53706

### Library data of the parts
LED700 = CMP-1426-00011-2: NexarPartId: 29717781; Color: Red; Luminous Intensity: 150mcd; Viewing Angle: 140°; Forward Voltage: 2V; Lens Style: Clear, Rectangular; Forward Current: 100mA; Dominant Wavelength: 625nm; Test Current: 20mA; Peak Wavelength: 630nm; Max Reverse Voltage (DC): 5V; RoHS: Compliant; Mount: Surface Mount; Case/Package: 0805; Case Code (Metric): 2012; Case Code (Imperial): 0805; Min Operating Temperature: -40°C; Max Operating Temperature: 85°C; Packaging: Tape and Reel; Wavelength: 625nm; Length: 2mm; Width: 1.25mm; Height: 700µm; REACH SVHC: Unknown
P700 = CMP-1502-01068-2: NexarPartId: 32855526; Contact Resistance: 20mΩ; Pitch: 2.54mm; Gender: Male; Number of Contacts: 5; Connector Type: Male Pin; Operating Supply Voltage: 250V; Current Rating: 3A; Orientation: Vertical; Packaging: Bulk; RoHS: Compliant; Mount: Through Hole; Contact Plating: Gold; Contact Material: Copper; Color: Black; Number of Rows: 1; Termination: Solder; Number of Positions: 5; Contact Mating Length: 5.9944mm; REACH SVHC: Unknown; Lead Free: Lead Free; Lead Pitch: 2.54mm; Number of Pins: 5; Min Operating Temperature: -40°C; Voltage Rating: 250V; Height: 8.89mm; Max Operating Temperature: 105°C
P701 = CMP-1502-01062-1: THT Vertical Pin Header WR-PHD, Pitch 2.54 mm, Single Row, 3 pins; Manufacturer: Wurth Elektronik; Manufacturer 1: Wurth Electronics; Withstanding Voltage: 500VAC; Working Voltage: 250VAC; Rated Current: 3A; Pitch: 2.54mm; Pin Number: 3; Gender: Male; Contact Resistance: 20mOhm; Package Reference: 61300311121; Manufacturer URL: http://www.we-online.de; Datasheet URL: https://katalog.we-online.de/em/datasheet/6130xx11121.pdf; Operating Temperature: -40to105degC; Part Number: 61300311121; Orientation: Vertical; Packaging: Bag; Row Number: Single; Mounting Technology: THT; Publisher: WurthElektronik; Supplier 1: Digi-Key; Supplier Part Number 1: 732-5316-ND; Manufacturer Part Number 1: 61300311121; RoHS: Yes; Category: Connectors; Stock 1: 225106; Pricing 1: 1=0.13, 10=0.113, 25=0.094, 50=0.079, 100=0.071, 1000=0.066 (USD); Mount: Through Hole; Contact Plating: Gold; Contact Material: Copper; Color: Black; Number of Rows: 1; Number of Positions: 3; Termination: Solder; Number of Contacts: 3; Series: WR-PHD; Contact Type: Male Pin; Contact Mating Length: 0.236inch; Lead Free: Lead Free; RoHS Compliant: Yes; Reach SVHC Compliant: Unknown; ComponentLink1URL: http://www.farnell.com/cad/1737268.pdf?src-supplier=Element14; ComponentLink1Description: http://www.farnell.com/cad/1737268.pdf?src-supplier=Element14; ComponentLink2URL: https://katalog.we-online.de/em/datasheet/6130xx11121.pdf?src-supplier=Digi-Key; ComponentLink2Description: https://katalog.we-online.de/em/datasheet/6130xx11121.pdf?src-supplier=Digi-Key; Supplier: Newark; Supplier Part Number: 20X0950; Manufacturer Part Number: 61300311121; Stock: 65141; Pricing: 1=0.133, 10=0.115, 25=0.096, 50=0.081, 100=0.072 (USD); ComponentLink3URL: https://datasheet.octopart.com/61300311121-W%C3%BCrth-Elektronik-datasheet-21154836.pdf?src-supplier=Element14; ComponentLink3Description: https://datasheet.octopart.com/61300311121-W%C3%BCrth-Elektronik-datasheet-21154836.pdf?src-supplier=Element14
R700 = CMP-1659-00013-4: as R300 on sheet 03_Connectors; Mount: Surface Mount; ComponentLink1Description: Manufacturer URL; ComponentLink2URL: http://www.yageo.com/documents/recent/PYu-RC_Group_51_RoHS_L_04.pdf; Pins: 2; Length: 2 mm; Min Operating Temperature: -55 degC; Height: 0.5 mm; Mounting Technology: Surface Mount; RoHSCompliant: true; REACH SVHC: No SVHC; ComponentLink1URL: http://www.yageo.com/; Max Operating Temperature: 155 degC; PackageReference: 0805; DatasheetVersion: Rev. 4, 02/2016; Package Quantity: 5000; Packaging: Tape and Reel; ComponentLink2Description: Datasheet; PackageDescription: 2-Pin Surface Mounted Device, Body 2 x 1.25 mm
R701 = CMP-1659-00013-4: as R315 on sheet 03_Connectors; Mount: Surface Mount; ComponentLink1Description: Manufacturer URL; ComponentLink2URL: http://www.yageo.com/documents/recent/PYu-RC_Group_51_RoHS_L_04.pdf; Pins: 2; Length: 2 mm; Min Operating Temperature: -55 degC; Height: 0.5 mm; Mounting Technology: Surface Mount; RoHSCompliant: true; REACH SVHC: No SVHC; ComponentLink1URL: http://www.yageo.com/; Max Operating Temperature: 155 degC; PackageReference: 0805; DatasheetVersion: Rev. 4, 02/2016; Package Quantity: 5000; Packaging: Tape and Reel; ComponentLink2Description: Datasheet; PackageDescription: 2-Pin Surface Mounted Device, Body 2 x 1.25 mm; Supplier 1: Digi-Key; Supplier Part Number 1: 311-10.0KCRCT-ND; Manufacturer 1: Yageo; Manufacturer Part Number 1: RC0805FR-0710KL; RoHS: Yes; Category: Chip SMD Resistors; Stock 1: 5682818; Pricing 1: 1=0.10000, 10=0.03800, 100=0.01560, 1000=0.00702, 2500=0.00610 (USD); Case/Package: 0805; Case Code (Imperial): 0805; Case Code (Metric): 2012; Size Code: 0805; Tolerance: 1%; Resistor Type: Thick Film; Series: RC; Number of Terminations: 2; Max Power Dissipation: 125mW; Termination: SMD/SMT; Features: Moisture Resistant; Construction: Rectangular; Resistance Tolerance: 1%; Technology: THICK FILM; Width: 0.049inch; Depth: 1.25mm; RoHS Compliant: Yes; Military Standard: Not; Lead Free: Lead Free; ComponentLink3URL: https://datasheet.ciiva.com/11808/0900766b8106beab-11808151.pdf?src-supplier=RSComponents; ComponentLink3Description: https://datasheet.ciiva.com/11808/0900766b8106beab-11808151.pdf?src-supplier=RSComponents; ComponentLink4URL: https://datasheet.ciiva.com/46447/444164-46447563.pdf?src-supplier=Element14; ComponentLink4Description: https://datasheet.ciiva.com/46447/444164-46447563.pdf?src-supplier=Element14; ComponentLink5URL: https://datasheet.ciiva.com/2456/pyu-r-int-thick-7-2456973.pdf?src-supplier=Digi-Key; ComponentLink5Description: https://datasheet.ciiva.com/2456/pyu-r-int-thick-7-2456973.pdf?src-supplier=Digi-Key; ComponentLink6URL: https://datasheet.ciiva.com/2456/pyu-r-int-thick-7-2456974.pdf?src-supplier=Digi-Key; ComponentLink6Description: https://datasheet.ciiva.com/2456/pyu-r-int-thick-7-2456974.pdf?src-supplier=Digi-Key; ComponentLink7URL: https://datasheet.ciiva.com/2456/pyu-r-int-thick-7-2456972.pdf?src-supplier=Digi-Key; ComponentLink7Description: https://datasheet.ciiva.com/2456/pyu-r-int-thick-7-2456972.pdf?src-supplier=Digi-Key; ComponentLink8URL: https://datasheet.ciiva.com/12669/rc0805-12669688.pdf?src-supplier=Mouser; ComponentLink8Description: https://datasheet.ciiva.com/12669/rc0805-12669688.pdf?src-supplier=Mouser; ComponentLink9URL: https://datasheet.ciiva.com/16747/rc0805-16747087.pdf?src-supplier=Future+Electronics; ComponentLink9Description: https://datasheet.ciiva.com/16747/rc0805-16747087.pdf?src-supplier=Future+Electronics; Supplier: Newark; Supplier Part Number: 05M4535; Manufacturer Part Number: RC0805FR-0710KL; Stock: 346650; Pricing: 1=0.102, 10=0.035, 25=0.028, 50=0.021, 100=0.014 (USD); Reach SVHC Compliant: Unknown; ComponentLink10URL: https://datasheet.ciiva.com/11808/0900766b8106beab-11808151.pdf?src-supplier=Rs; ComponentLink10Description: https://datasheet.ciiva.com/11808/0900766b8106beab-11808151.pdf?src-supplier=Rs
R702 = CMP-2000-06960-1: as R301 on sheet 03_Connectors; Datasheet Version: Rev. 7, 05/2017; Termination Style: SMD/SMT; Case Code - mm: 2012; Package Description: 2-Pin Surface Mounted Device, Body 2 x 1.25 mm; Operating Temperature Range: -55Cto+155C; Case Code - in: 0805; Packaging: Reel; Tolerance: 1%; Package Reference: 0805; Mounting Technology: SurfaceMount; Product: ThickFilmResistorsGeneralPurpose; Series: RC; Manufacturer URL: http://www.yageo.com/; Datasheet URL: http://www.yageo.com/documents/recent/PYu-RC_Group_51_RoHS_L_7.pdf
SW700 = CMP-2000-05602-2: Swicth, SPST, 24 V, -35 to 85 degC, 4-Pin SMD, RoHS, Tape and Reel; Manufacturer: TE Connectivity; Switch Travel: 0.25mm; Mechanical Life: 100000Cycles; Contact Current Rating: 50mA; Operating Force: 1.57N; Actuator Material: Polyamide; Contact Resistance: 100mOhm; Voltage Rating: 24V; Illumination Type: Illuminated; Actuator Length: 0.055inch; Max Voltage Rating (DC): 12V; Case\/Package: SMD/SMT; Switch Function: Off-Mom; Actuator Type: Standard; Insulation Resistance: 100MR; Orientation: Straight; Datasheet URL: http://www.te.com/commerce/DocumentDelivery/DDEController?Action=showdoc&DocId=Customer+Drawing%7F2-1437565-7%7FV%7Fpdf%7FEnglish%7FENG_CD_2-1437565-7_V.pdf%7F4-1437565-2; Min Operating Temperature: -35degC; Packaging: LoosePiece; Termination: GullWing; Throw Configuration: SPST; Package Description: 4-Pin Surface Mount Device, Body 6 x 6 mm, Pitch 4.5 mm; Mounting Technology: SurfaceMount; Contact Plating: Silver; Datasheet Version: Rev. V, 02/2015; RoHSCompliant: true; Max Operating Temperature: 85degC; Length: 6mm; Voltage Rating (DC): 24V; Electrical Life: 100000Cycles; Current Rating: 50mA; Package Quantity: 750; Mount: SurfaceMount; Package Reference: FSM4JSMA; Manufacturer URL: http://www.te.com/; Width: 6mm; REACH SVHC: Unknown; Contact Material: CopperAlloy; Supplier 1: Digi-Key; Supplier Part Number 1: 450-1129-ND; Manufacturer 1: TE Connectivity; Manufacturer Part Number 1: FSM4JSMA; RoHS: Yes; Category: Pushbutton Switches; Stock 1: 65608; Pricing 1: 1=0.27000, 10=0.26300, 25=0.24960, 100=0.22600, 250=0.20604, 750=0.19152, 1500=0.16339, 3000=0.15885, 5250=0.14977 (USD); Case/Package: SMD/SMT; Color: Black; Series: FSMJSMA; Max Current Rating: 50mA; Depth: 10mm; Radiation Hardening: No; RoHS Compliant: Yes; Lead Free: Lead Free; ELV: Compliant; Supplier: Newark; Supplier Part Number: 27AC5877; Manufacturer Part Number: FSM4JSMA; Stock: 46743; Pricing: 1=0.292, 10=0.274, 25=0.255, 100=0.232, 500=0.2, 1000=0.166 (USD); Reach SVHC Compliant: Unknown
U700 = CMP-0859-00236-3: Single 3-Input Positive-AND Gate, DBV0006A, LARGE T&R; Manufacturer: Texas Instruments; Output Type: CMOS; Voltage(Nom)(V): 1.8,2.5,3.3,5; ICC @ Nom Voltage(Max)(mA): 0.01; VCC(Min)(V): 1.65; Output Drive (IOL/IOH)(Max)(mA): 32/-32; Schmitt Trigger: No; Input Type: CMOS/TTL; VCC(Max)(V): 5.5; Gate Type: AND; Rating: Catalog; tpd @ Nom Voltage(Max)(ns): 20,7.8,6.2,4.6; Bits(#): 1; F @ Nom Voltage(Max)(Mhz): 150; Logic: True; Technology Family: LVC; Sub-Family: AND Gate; PackageReference: DBV0006A; Operating Temperature Range(C): -40 to 125,-40 to 85; DatasheetVersion: SCES487F; 3-State Output: No; Generic Part Number: SN74LVC1G11